# Altium schematic sheet uc_sram.SchDoc
size A
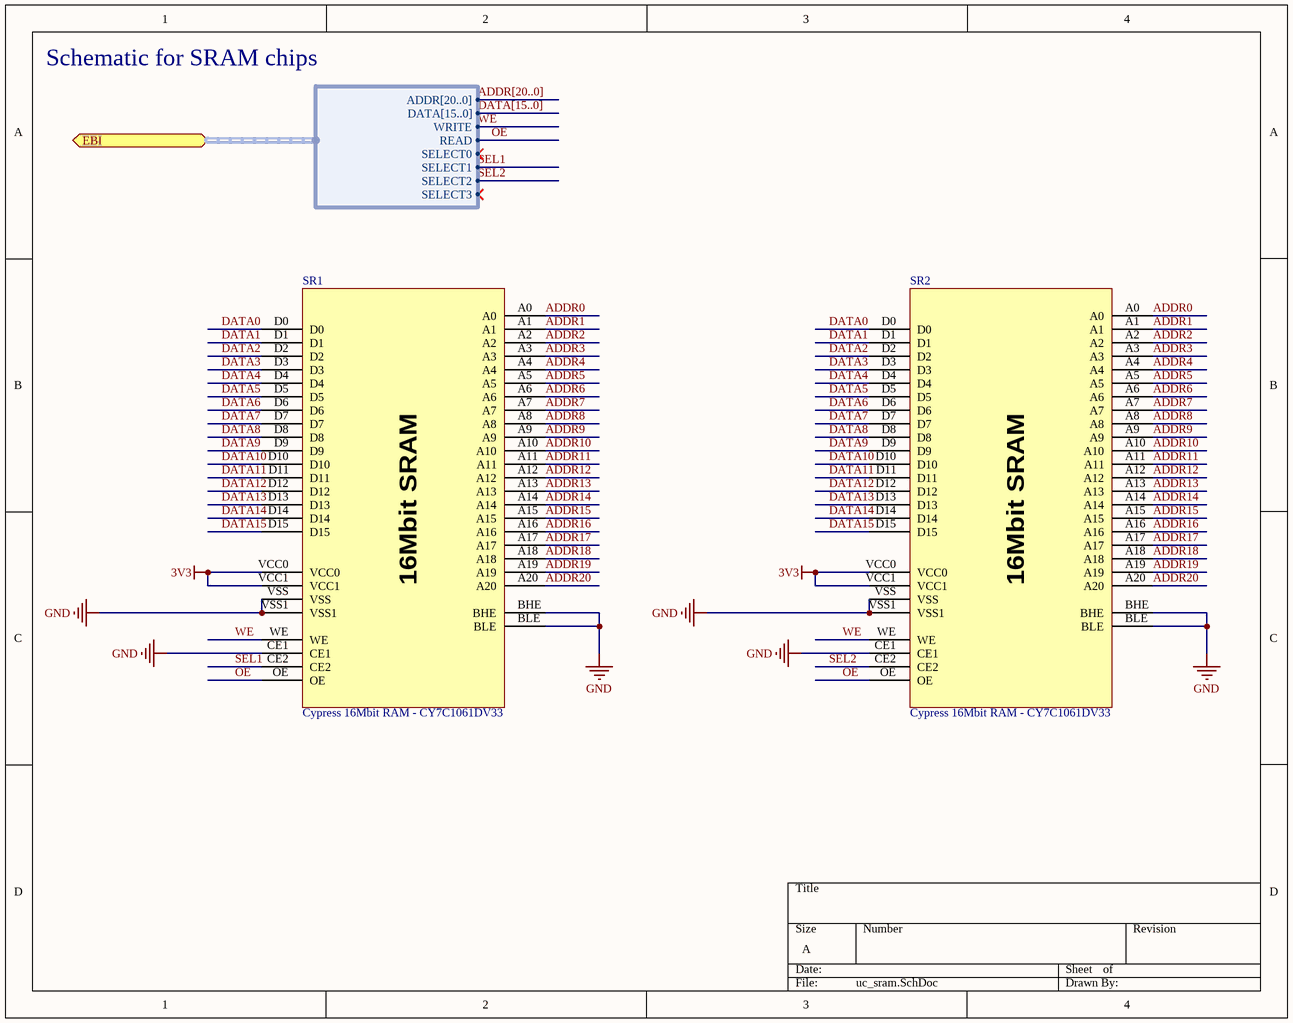
[diagram p0: uc_sram.SchDoc]

## Parts
SR1  Cypress 16Mbit RAM - CY7C1061DV33  [BGA48C75P8X6_950X800X100]
SR2  Cypress 16Mbit RAM - CY7C1061DV33  [BGA48C75P8X6_950X800X100]

## Ports
EBI (harness EBI)

## Harnesses
EBI: ADDR[20..0], DATA[15..0], WRITE, READ, SELECT0, SELECT1, SELECT2, SELECT3

## Nets
3V3: SR1.VCC0 SR1.VCC1 SR2.VCC0 SR2.VCC1
GND: SR1.BHE SR1.BLE SR1.CE1 SR1.VSS SR1.VSS1 SR2.BHE SR2.BLE SR2.CE1 SR2.VSS SR2.VSS1
ADDR0: SR1.A0 SR2.A0
ADDR1: SR1.A1 SR2.A1
ADDR2: SR1.A2 SR2.A2
ADDR3: SR1.A3 SR2.A3
ADDR4: SR1.A4 SR2.A4
ADDR5: SR1.A5 SR2.A5
ADDR6: SR1.A6 SR2.A6
ADDR7: SR1.A7 SR2.A7
ADDR8: SR1.A8 SR2.A8
ADDR9: SR1.A9 SR2.A9
ADDR10: SR1.A10 SR2.A10
ADDR11: SR1.A11 SR2.A11
ADDR12: SR1.A12 SR2.A12
ADDR13: SR1.A13 SR2.A13
ADDR14: SR1.A14 SR2.A14
ADDR15: SR1.A15 SR2.A15
ADDR16: SR1.A16 SR2.A16
ADDR17: SR1.A17 SR2.A17
ADDR18: SR1.A18 SR2.A18
ADDR19: SR1.A19 SR2.A19
ADDR20: SR1.A20 SR2.A20
DATA0: SR1.D0 SR2.D0
DATA1: SR1.D1 SR2.D1
DATA2: SR1.D2 SR2.D2
DATA3: SR1.D3 SR2.D3
DATA4: SR1.D4 SR2.D4
DATA5: SR1.D5 SR2.D5
DATA6: SR1.D6 SR2.D6
DATA7: SR1.D7 SR2.D7
DATA8: SR1.D8 SR2.D8
DATA9: SR1.D9 SR2.D9
DATA10: SR1.D10 SR2.D10
DATA11: SR1.D11 SR2.D11
DATA12: SR1.D12 SR2.D12
DATA13: SR1.D13 SR2.D13
DATA14: SR1.D14 SR2.D14
DATA15: SR1.D15 SR2.D15
OE: SR1.OE SR2.OE ; port EBI.READ
SEL1: SR1.CE2 ; port EBI.SELECT1
SEL2: SR2.CE2 ; port EBI.SELECT2
WE: SR1.WE SR2.WE ; port EBI.WRITE

## Buses and harness runs
bus ADDR[20..0]
bus DATA[15..0]

## Notes on the sheet
- Schematic for SRAM chips
- (in symbol Cypress 16Mbit RAM - CY7C1061DV33) 16Mbit SRAM

## Library data of the parts
SR1 SR2 = Cypress 16Mbit RAM - CY7C1061DV33: pin to pad: A0>A3 A1>A4 A2>A5 A3>B3 A4>B4 A5>C3 A6>C4 A7>D4 A8>H2 A9>H3 A10>H4 A11>H5 A12>G3 A13>G4 A14>F3 A15>F4 A16>E4 A17>D3 A18>H1 A19>H6 A20>G2 BHE>B2 BLE>A1 CE1>B5 CE2>A6 D0>B6 D1>C5 D2>C6 D3>D5 D4>E5 D5>F5 D6>F6 D7>G6 D8>B1 D9>C1 D10>C2 D11>D2 D12>E2 D13>F2 D14>F1 D15>G1 OE>A2 VCC0>E1 VCC1>D6 VSS>D1 VSS1>E6 WE>G5